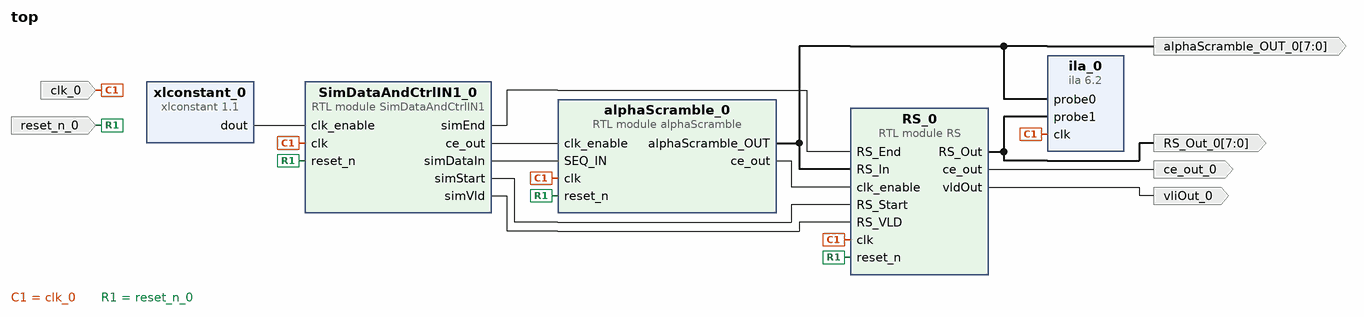
[diagram p0: block diagram of the top level]
# Vivado block design top, xc7z020clg400-3, Vivado 2023.2
create_bd_design top

create_bd_port -dir O -from 7 -to 0 alphaScramble_OUT_0
create_bd_port -dir O ce_out_0
create_bd_port -dir I -type clk clk_0
create_bd_port -dir I -type rst reset_n_0
create_bd_port -dir O -from 7 -to 0 RS_Out_0
create_bd_port -dir O vliOut_0

create_bd_cell -type module -reference alphaScramble alphaScramble_0
create_bd_cell -type ip -vlnv xilinx.com:ip:xlconstant:1.1 xlconstant_0
create_bd_cell -type ip -vlnv xilinx.com:ip:ila:6.2 ila_0
set_property -dict [list \
  CONFIG.ALL_PROBE_SAME_MU_CNT 1 \
  CONFIG.C_DATA_DEPTH 4096 \
  CONFIG.C_MONITOR_TYPE Native \
  CONFIG.C_NUM_OF_PROBES 2 \
  CONFIG.C_PROBE0_WIDTH 8 \
  CONFIG.C_PROBE1_WIDTH 8 \
  CONFIG.C_TRIGIN_EN false \
] [get_bd_cells ila_0]
create_bd_cell -type module -reference SimDataAndCtrlIN1 SimDataAndCtrlIN1_0
create_bd_cell -type module -reference RS RS_0

# ---- connections ----

connect_bd_net [get_bd_pins RS_0/RS_Out] [get_bd_ports RS_Out_0] [get_bd_pins ila_0/probe1]
connect_bd_net [get_bd_pins RS_0/ce_out] [get_bd_ports ce_out_0]
connect_bd_net [get_bd_pins RS_0/vldOut] [get_bd_ports vliOut_0]
connect_bd_net [get_bd_pins SimDataAndCtrlIN1_0/ce_out] [get_bd_pins alphaScramble_0/clk_enable]
connect_bd_net [get_bd_pins SimDataAndCtrlIN1_0/simDataIn] [get_bd_pins alphaScramble_0/SEQ_IN]
connect_bd_net [get_bd_pins SimDataAndCtrlIN1_0/simEnd] [get_bd_pins RS_0/RS_End]
connect_bd_net [get_bd_pins SimDataAndCtrlIN1_0/simStart] [get_bd_pins RS_0/RS_Start]
connect_bd_net [get_bd_pins SimDataAndCtrlIN1_0/simVld] [get_bd_pins RS_0/RS_VLD]
connect_bd_net [get_bd_pins alphaScramble_0/alphaScramble_OUT] [get_bd_ports alphaScramble_OUT_0] [get_bd_pins ila_0/probe0] [get_bd_pins RS_0/RS_In]
connect_bd_net [get_bd_pins alphaScramble_0/ce_out] [get_bd_pins RS_0/clk_enable]
connect_bd_net -net clk_0_1 [get_bd_ports clk_0] \
  [get_bd_pins ila_0/clk] [get_bd_pins alphaScramble_0/clk] [get_bd_pins SimDataAndCtrlIN1_0/clk] [get_bd_pins RS_0/clk]
connect_bd_net -net reset_n_0_1 [get_bd_ports reset_n_0] \
  [get_bd_pins alphaScramble_0/reset_n] [get_bd_pins SimDataAndCtrlIN1_0/reset_n] [get_bd_pins RS_0/reset_n]
connect_bd_net [get_bd_pins xlconstant_0/dout] [get_bd_pins SimDataAndCtrlIN1_0/clk_enable]

validate_bd_design
save_bd_design
